# Altium schematic sheet Sheet2.SchDoc
size A; SheetNumber: 1; SheetTotal: 1
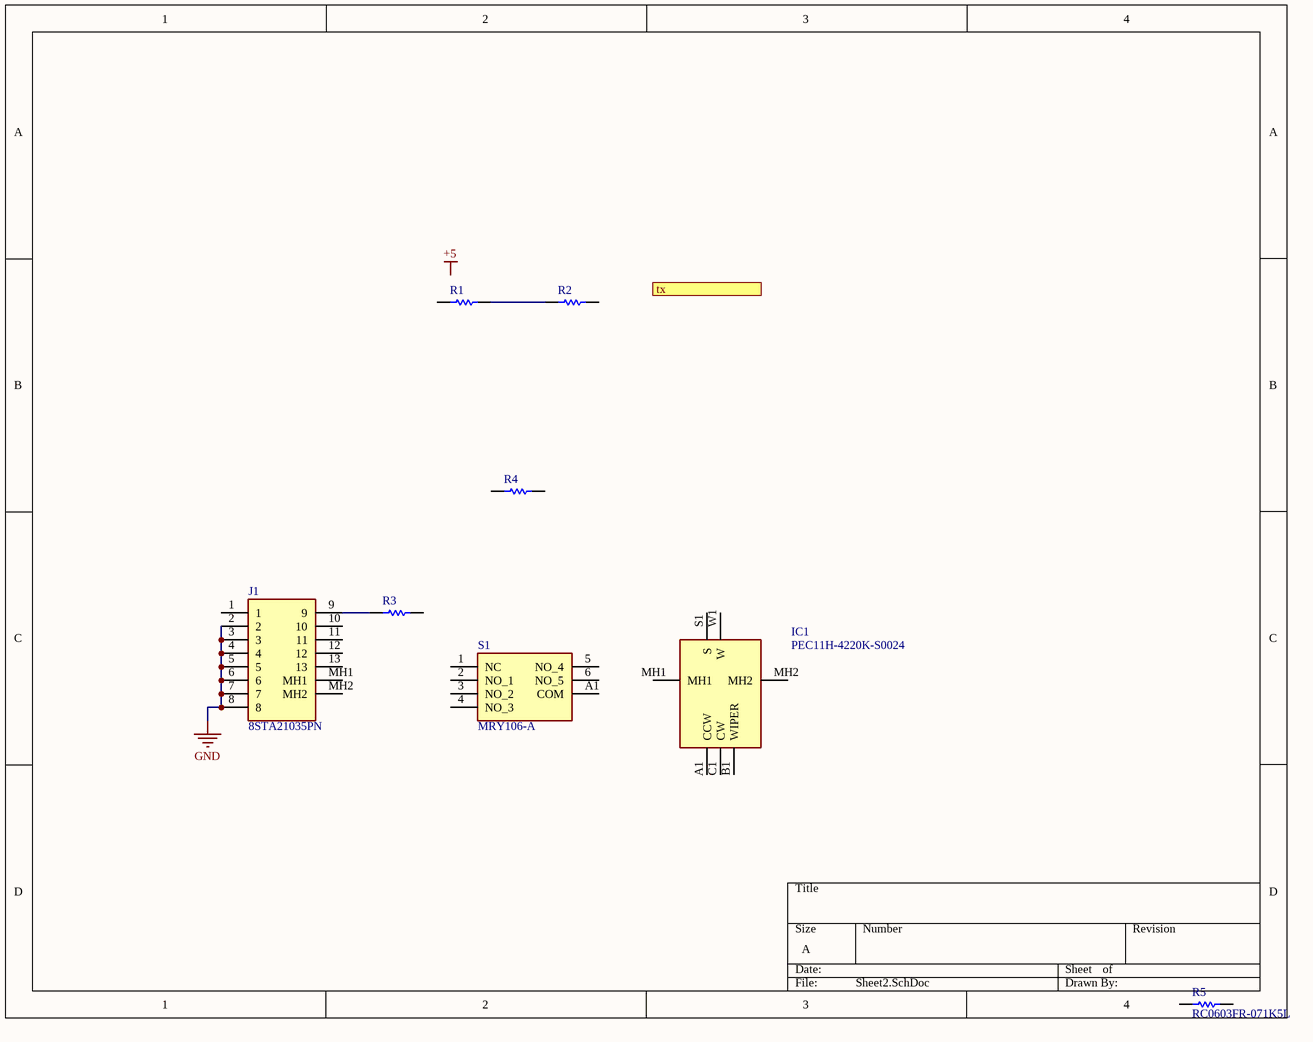
[diagram p0: Sheet2.SchDoc]

## Parts
IC1  PEC11H-4220K-S0024  [PEC11H4220KS0024]
J1  8STA21035PN  [8STA21035PN]
R1  RC0603FR-071K5L  [RESC1608X55X25ML10T15]  (value not drawn)
R2  RC0603FR-071K5L  [RESC1608X55X25ML10T15]  (value not drawn)
R3  RC0603FR-071K5L  [RESC1608X55X25ML10T15]  (value not drawn)
R4  RC0603FR-071K5L  [RESC1608X55X25ML10T15]  (value not drawn)
R5  RC0603FR-071K5L  [RESC1608X55X25ML10T15]
S1  MRY106-A  [MRY106A]

## Ports
tx

## Nets
GND: J1.2 J1.3 J1.4 J1.5 J1.6 J1.7 J1.8
NetJ1_9: J1.9 R3.1
NetR1_2: R1.2 R2.1

Not connected (* = marked no-connect by the designer): IC1 A1(CCW) B1(WIPER) C1(CW) MH1 MH2 S1(S) W1(W); J1 1 10 11 12 13 MH1 MH2; R1 1; R2 2; R3 2; R4 1 2; R5 1 2; S1 1(NC) 2(NO_1) 3(NO_2) 4(NO_3) 5(NO_4) 6(NO_5) A1(COM)

## Notes on the sheet
- Labels drawn without touching a wire or pin: +5

## Library data of the parts
IC1 = PEC11H-4220K-S0024: Integrated Circuit; Manufacturer_Name: Bourns; Datasheet Link: http://www.bourns.com/docs/Product-Datasheets/PEC11H.pdf; Height: 26.5mm; Manufacturer_Part_Number: PEC11H-4220K-S0024; Mouser Part Number: 652-PEC11H4220KS0024; Mouser Price/Stock: https://www.mouser.co.uk/ProductDetail/Bourns/PEC11H-4220K-S0024?qs=7MVldsJ5UazL2X7%252BHN%252B7sQ%3D%3D; Arrow Part Number: PEC11H-4220K-S0024; Arrow Price/Stock: https://www.arrow.com/en/products/pec11h-4220k-s0024/bourns?region=nac
J1 = 8STA21035PN: Connector; Manufacturer_Name: Sunbank / Souriau; Height: 27.65mm; Manufacturer_Part_Number: 8STA21035PN
R1-R5 = CMP-2100-03665-1: Chip Resistor, 1.5 KOhm, +/- 1%, 0.1 W, -55 to 155 degC, 0603 (1608 Metric), RoHS, Tape and Reel; Manufacturer: Yageo; Power Rating: 100mW; Voltage Rating: 50V; Temperature Coefficient: 100ppm/degreesC; Military Standard: Not; Datasheet URL: http://www.yageo.com/NewPortal/yageodocoutput?fileName=/pdf/R-Chip/PYu-RC_Group_51_RoHS_L_5.pdf; Package Description: 2-Pin Surface Mount Device, Body 1.6 x 0.8 mm; Composition: ThickFilm; Case Code (Metric): 1608; Case/Package: 0603; Number of Terminations: 2; Depth: 0.8mm; Height: 0.022inch; Manufacturer URL: http://www.yageo.com/; Lead Free: LeadFree; Min Operating Temperature: -55degC; Max Operating Temperature: 155degC; Datasheet Version: Rev. 5, 10/2016; RoHSCompliant: true; Max Power Dissipation: 100mW; Packaging: TapeandReel; Voltage Rating (DC): 50V; Length: 0.063inch; Tolerance: 1%; Width: 0.031inch; Number of Pins: 2; Termination: SMD/SMT; Package Reference: 0603; Package Quantity: 1; Case Code (Imperial): 0603; Resistance: 1.5KOhm; REACH SVHC: NoSVHC
S1 = MRY106-A: Switch; Manufacturer_Name: NKK Switches; Datasheet Link: http://www.nkkswitches.com/pdf/MRpowerLevel.pdf; Height: 42.5mm; Manufacturer_Part_Number: MRY106-A; Mouser Part Number: 633-MRY106A; Mouser Price/Stock: https://www.mouser.co.uk/ProductDetail/NKK-Switches/MRY106-A?qs=vtN2KNUHTpWsG2Pe3z28oQ%3D%3D; Arrow Part Number: MRY106-A; Arrow Price/Stock: https://www.arrow.com/en/products/mry106-a/nkk-switches?region=nac